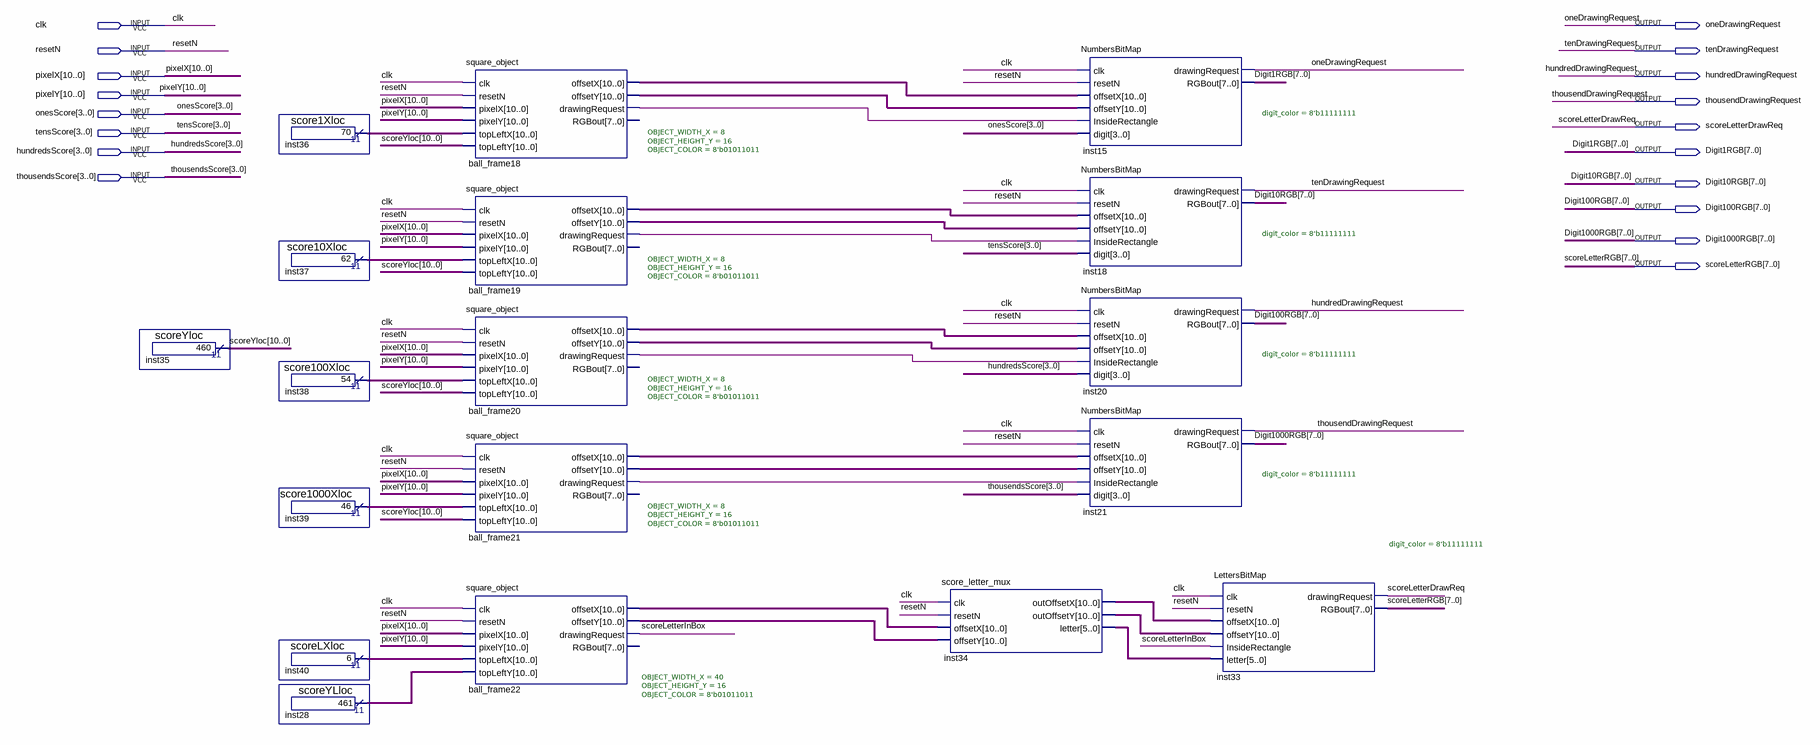
[diagram p0: schematic sheet]
// Quartus schematic scoreDisplay.bdf as structural Verilog: 18 symbols, 18 pins
module scoreDisplay (
  input  clk,
  input  resetN,
  input  [10:0] pixelX,
  input  [10:0] pixelY,
  input  [3:0] onesScore,
  input  [3:0] tensScore,
  input  [3:0] hundredsScore,
  input  [3:0] thousendsScore,
  output oneDrawingRequest,
  output tenDrawingRequest,
  output hundredDrawingRequest,
  output thousendDrawingRequest,
  output scoreLetterDrawReq,
  output [7:0] Digit1RGB,
  output [7:0] Digit10RGB,
  output [7:0] Digit100RGB,
  output [7:0] Digit1000RGB,
  output [7:0] scoreLetterRGB
);

  wire ball_frame18_drawingrequest, ball_frame19_drawingrequest, ball_frame20_drawingrequest,
       ball_frame21_drawingrequest, scoreLetterInBox;
  wire [5:0] inst34_letter;
  wire [10:0] ball_frame18_offsetx, ball_frame18_offsety, ball_frame19_offsetx, ball_frame19_offsety,
       ball_frame20_offsetx, ball_frame20_offsety, ball_frame21_offsetx, ball_frame21_offsety,
       ball_frame22_offsetx, ball_frame22_offsety, inst28_result, inst34_outoffsetx, inst34_outoffsety,
       inst36_result, inst37_result, inst38_result, inst39_result, inst40_result, scoreYloc;

  scoreYloc inst35 (.result(scoreYloc));
  score1Xloc inst36 (.result(inst36_result));
  score10Xloc inst37 (.result(inst37_result));
  score100Xloc inst38 (.result(inst38_result));
  score1000Xloc inst39 (.result(inst39_result));
  scoreLXloc inst40 (.result(inst40_result));
  scoreYLloc inst28 (.result(inst28_result));
  square_object #(.OBJECT_WIDTH_X(8), .OBJECT_HEIGHT_Y(16), .OBJECT_COLOR(8'b01011011)) ball_frame18 (
    .clk(clk), .resetN(resetN), .pixelX(pixelX), .pixelY(pixelY), .topLeftX(inst36_result),
    .topLeftY(scoreYloc), .offsetX(ball_frame18_offsetx), .offsetY(ball_frame18_offsety),
    .drawingRequest(ball_frame18_drawingrequest));  // open: RGBout
  square_object #(.OBJECT_WIDTH_X(8), .OBJECT_HEIGHT_Y(16), .OBJECT_COLOR(8'b01011011)) ball_frame19 (
    .clk(clk), .resetN(resetN), .pixelX(pixelX), .pixelY(pixelY), .topLeftX(inst37_result),
    .topLeftY(scoreYloc), .offsetX(ball_frame19_offsetx), .offsetY(ball_frame19_offsety),
    .drawingRequest(ball_frame19_drawingrequest));  // open: RGBout
  square_object #(.OBJECT_WIDTH_X(8), .OBJECT_HEIGHT_Y(16), .OBJECT_COLOR(8'b01011011)) ball_frame20 (
    .clk(clk), .resetN(resetN), .pixelX(pixelX), .pixelY(pixelY), .topLeftX(inst38_result),
    .topLeftY(scoreYloc), .offsetX(ball_frame20_offsetx), .offsetY(ball_frame20_offsety),
    .drawingRequest(ball_frame20_drawingrequest));  // open: RGBout
  square_object #(.OBJECT_WIDTH_X(8), .OBJECT_HEIGHT_Y(16), .OBJECT_COLOR(8'b01011011)) ball_frame21 (
    .clk(clk), .resetN(resetN), .pixelX(pixelX), .pixelY(pixelY), .topLeftX(inst39_result),
    .topLeftY(scoreYloc), .offsetX(ball_frame21_offsetx), .offsetY(ball_frame21_offsety),
    .drawingRequest(ball_frame21_drawingrequest));  // open: RGBout
  square_object #(.OBJECT_WIDTH_X(40), .OBJECT_HEIGHT_Y(16), .OBJECT_COLOR(8'b01011011)) ball_frame22 (
    .clk(clk), .resetN(resetN), .pixelX(pixelX), .pixelY(pixelY), .topLeftX(inst40_result),
    .topLeftY(inst28_result), .offsetX(ball_frame22_offsetx), .offsetY(ball_frame22_offsety),
    .drawingRequest(scoreLetterInBox));  // open: RGBout
  score_letter_mux inst34 (
    .clk(clk), .resetN(resetN), .offsetX(ball_frame22_offsetx), .offsetY(ball_frame22_offsety),
    .outOffsetX(inst34_outoffsetx), .outOffsetY(inst34_outoffsety), .letter(inst34_letter));
  NumbersBitMap #(.digit_color(8'b11111111)) inst15 (
    .clk(clk), .resetN(resetN), .offsetX(ball_frame18_offsetx), .offsetY(ball_frame18_offsety),
    .InsideRectangle(ball_frame18_drawingrequest), .digit(onesScore), .drawingRequest(oneDrawingRequest),
    .RGBout(Digit1RGB));
  NumbersBitMap #(.digit_color(8'b11111111)) inst18 (
    .clk(clk), .resetN(resetN), .offsetX(ball_frame19_offsetx), .offsetY(ball_frame19_offsety),
    .InsideRectangle(ball_frame19_drawingrequest), .digit(tensScore), .drawingRequest(tenDrawingRequest),
    .RGBout(Digit10RGB));
  NumbersBitMap #(.digit_color(8'b11111111)) inst20 (
    .clk(clk), .resetN(resetN), .offsetX(ball_frame20_offsetx), .offsetY(ball_frame20_offsety),
    .InsideRectangle(ball_frame20_drawingrequest), .digit(hundredsScore),
    .drawingRequest(hundredDrawingRequest), .RGBout(Digit100RGB));
  NumbersBitMap #(.digit_color(8'b11111111)) inst21 (
    .clk(clk), .resetN(resetN), .offsetX(ball_frame21_offsetx), .offsetY(ball_frame21_offsety),
    .InsideRectangle(ball_frame21_drawingrequest), .digit(thousendsScore),
    .drawingRequest(thousendDrawingRequest), .RGBout(Digit1000RGB));
  LettersBitMap #(.digit_color(8'b11111111)) inst33 (
    .clk(clk), .resetN(resetN), .offsetX(inst34_outoffsetx), .offsetY(inst34_outoffsety),
    .InsideRectangle(scoreLetterInBox), .letter(inst34_letter), .drawingRequest(scoreLetterDrawReq),
    .RGBout(scoreLetterRGB));
endmodule
